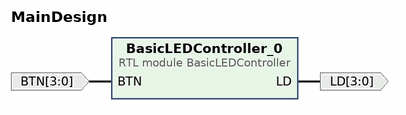
[diagram p0: block diagram of the top level]
# Vivado block design MainDesign, xc7z020clg400-1, Vivado 2022.2
create_bd_design MainDesign

create_bd_port -dir O -from 3 -to 0 LD
create_bd_port -dir I -from 3 -to 0 BTN

create_bd_cell -type module -reference BasicLEDController BasicLEDController_0

# ---- connections ----

connect_bd_net [get_bd_ports BTN] [get_bd_pins BasicLEDController_0/BTN]
connect_bd_net [get_bd_pins BasicLEDController_0/LD] [get_bd_ports LD]

validate_bd_design
save_bd_design
